# Altium project light_sensor.PrjPcb
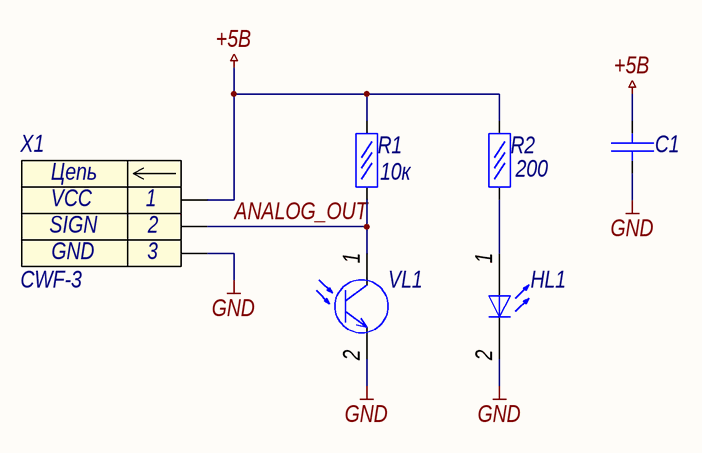
[diagram p0: Sheet.SchDoc]
1 sheet, 6 parts. Net scope: global (net labels, ports and power ports of the same name join across sheets).
Board file: loight_sensor.PcbDoc

## Sheet Sheet.SchDoc: =title_line_1 + title_line_2
size 209 x 297 mm; SheetNumber: 1; SheetTotal: 1

### Parts
C1  (no value)  [C0805_AA]
HL1  (no value)  [PCBComponent_2]
R1  10к  [R1206]
R2  200  [R1206]
VL1  (no value)  [PCBComponent_1]
X1  CWF-3  [CWF-3]

### Nets
+5В: C1.1 R1.2 R2.2 X1.1
GND: C1.2 HL1.2(K) VL1.2(E) X1.3
ANALOG_OUT: R1.1 VL1.1(C) X1.2
NetHL1_1: HL1.1(A) R2.1

### Notes on the sheet
- Перв. примен.
- Справ. №
- Подп. и дата
- Инв. № дубл.
- Нормоконтроль:
- Взам. инв. №
- Изм.
- Лист
- № докум.
- Подп.
- Дата
- Лит.
- Масса
- Масштаб
- Т.контр.
- Пров.
- Разраб.
- Листов
- Разработал:
- Инв. № подл.
- Н.контр.
- Утв.
- Копировал
- Формат
- А4
- (in symbol Header_3_plg) Цепь

### Library data of the parts
C1 = Конденсатор кер.
HL1 = IR LED
R1 R2 = Резистор  0,05Вт: Резистор 0,05Вт; Power rating: 0,05Вт
VL1 = phototransistor
X1 = Header_3_plg: Разъем - 3 конт. вилка; Contact_1: VCC; Contact_2: SIGN; Contact_3: GND; Name: CWF-3